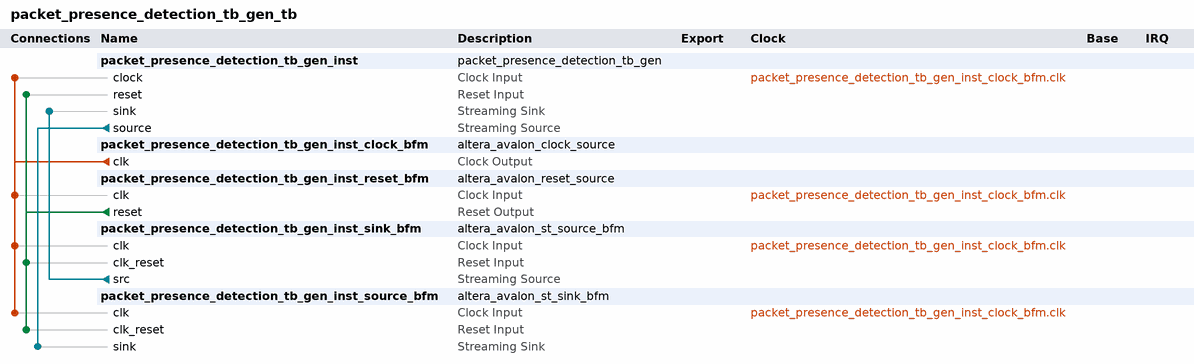
[diagram p0: system contents]
# Platform Designer (Qsys) system packet_presence_detection_tb_gen_tb, MAX 10 10M16SAU169C8G
# Parameters at their usual value, and those the tool derives, are not listed.
package require -exact qsys 18.1
create_system packet_presence_detection_tb_gen_tb
set_project_property DEVICE_FAMILY {MAX 10}
set_project_property DEVICE 10M16SAU169C8G

add_instance packet_presence_detection_tb_gen_inst packet_presence_detection_tb_gen 1.0

add_instance packet_presence_detection_tb_gen_inst_clock_bfm altera_avalon_clock_source 18.1
set_instance_parameter_value packet_presence_detection_tb_gen_inst_clock_bfm CLOCK_RATE 100000000

add_instance packet_presence_detection_tb_gen_inst_reset_bfm altera_avalon_reset_source 18.1
set_instance_parameter_value packet_presence_detection_tb_gen_inst_reset_bfm ASSERT_HIGH_RESET 1
set_instance_parameter_value packet_presence_detection_tb_gen_inst_reset_bfm INITIAL_RESET_CYCLES 50

add_instance packet_presence_detection_tb_gen_inst_sink_bfm altera_avalon_st_source_bfm 18.1
set_instance_parameter_value packet_presence_detection_tb_gen_inst_sink_bfm ST_CHANNEL_W 1
set_instance_parameter_value packet_presence_detection_tb_gen_inst_sink_bfm ST_ERROR_W 1
set_instance_parameter_value packet_presence_detection_tb_gen_inst_sink_bfm ST_MAX_CHANNELS 0
set_instance_parameter_value packet_presence_detection_tb_gen_inst_sink_bfm ST_NUMSYMBOLS 2
set_instance_parameter_value packet_presence_detection_tb_gen_inst_sink_bfm ST_SYMBOL_W 12
set_instance_parameter_value packet_presence_detection_tb_gen_inst_sink_bfm USE_CHANNEL 0
set_instance_parameter_value packet_presence_detection_tb_gen_inst_sink_bfm USE_EMPTY 0
set_instance_parameter_value packet_presence_detection_tb_gen_inst_sink_bfm USE_ERROR 0
set_instance_parameter_value packet_presence_detection_tb_gen_inst_sink_bfm USE_PACKET 0
set_instance_parameter_value packet_presence_detection_tb_gen_inst_sink_bfm USE_READY 0
set_instance_parameter_value packet_presence_detection_tb_gen_inst_sink_bfm USE_VALID 1

add_instance packet_presence_detection_tb_gen_inst_source_bfm altera_avalon_st_sink_bfm 18.1
set_instance_parameter_value packet_presence_detection_tb_gen_inst_source_bfm ST_CHANNEL_W 1
set_instance_parameter_value packet_presence_detection_tb_gen_inst_source_bfm ST_ERROR_W 1
set_instance_parameter_value packet_presence_detection_tb_gen_inst_source_bfm ST_MAX_CHANNELS 0
set_instance_parameter_value packet_presence_detection_tb_gen_inst_source_bfm ST_NUMSYMBOLS 2
set_instance_parameter_value packet_presence_detection_tb_gen_inst_source_bfm ST_READY_LATENCY 0
set_instance_parameter_value packet_presence_detection_tb_gen_inst_source_bfm ST_SYMBOL_W 12
set_instance_parameter_value packet_presence_detection_tb_gen_inst_source_bfm USE_CHANNEL 0
set_instance_parameter_value packet_presence_detection_tb_gen_inst_source_bfm USE_EMPTY 0
set_instance_parameter_value packet_presence_detection_tb_gen_inst_source_bfm USE_ERROR 0
set_instance_parameter_value packet_presence_detection_tb_gen_inst_source_bfm USE_PACKET 0
set_instance_parameter_value packet_presence_detection_tb_gen_inst_source_bfm USE_READY 0
set_instance_parameter_value packet_presence_detection_tb_gen_inst_source_bfm USE_VALID 1
set_instance_parameter_value packet_presence_detection_tb_gen_inst_source_bfm VHDL_ID 0

# connections
add_connection packet_presence_detection_tb_gen_inst_clock_bfm.clk packet_presence_detection_tb_gen_inst.clock clock
add_connection packet_presence_detection_tb_gen_inst_clock_bfm.clk packet_presence_detection_tb_gen_inst_reset_bfm.clk clock
add_connection packet_presence_detection_tb_gen_inst_clock_bfm.clk packet_presence_detection_tb_gen_inst_sink_bfm.clk clock
add_connection packet_presence_detection_tb_gen_inst_clock_bfm.clk packet_presence_detection_tb_gen_inst_source_bfm.clk clock
add_connection packet_presence_detection_tb_gen_inst_reset_bfm.reset packet_presence_detection_tb_gen_inst.reset reset
add_connection packet_presence_detection_tb_gen_inst_reset_bfm.reset packet_presence_detection_tb_gen_inst_sink_bfm.clk_reset reset
add_connection packet_presence_detection_tb_gen_inst_reset_bfm.reset packet_presence_detection_tb_gen_inst_source_bfm.clk_reset reset
add_connection packet_presence_detection_tb_gen_inst.source packet_presence_detection_tb_gen_inst_source_bfm.sink avalon_streaming
add_connection packet_presence_detection_tb_gen_inst_sink_bfm.src packet_presence_detection_tb_gen_inst.sink avalon_streaming

set_interconnect_requirement {$system} qsys_mm.clockCrossingAdapter HANDSHAKE
set_interconnect_requirement {$system} qsys_mm.enableEccProtection FALSE
set_interconnect_requirement {$system} qsys_mm.insertDefaultSlave FALSE
set_interconnect_requirement {$system} qsys_mm.maxAdditionalLatency 1

save_system packet_presence_detection_tb_gen_tb.qsys
